# EAGLE board STM32-E407_Rev_F (EAGLE 4.16), part 1 of 2
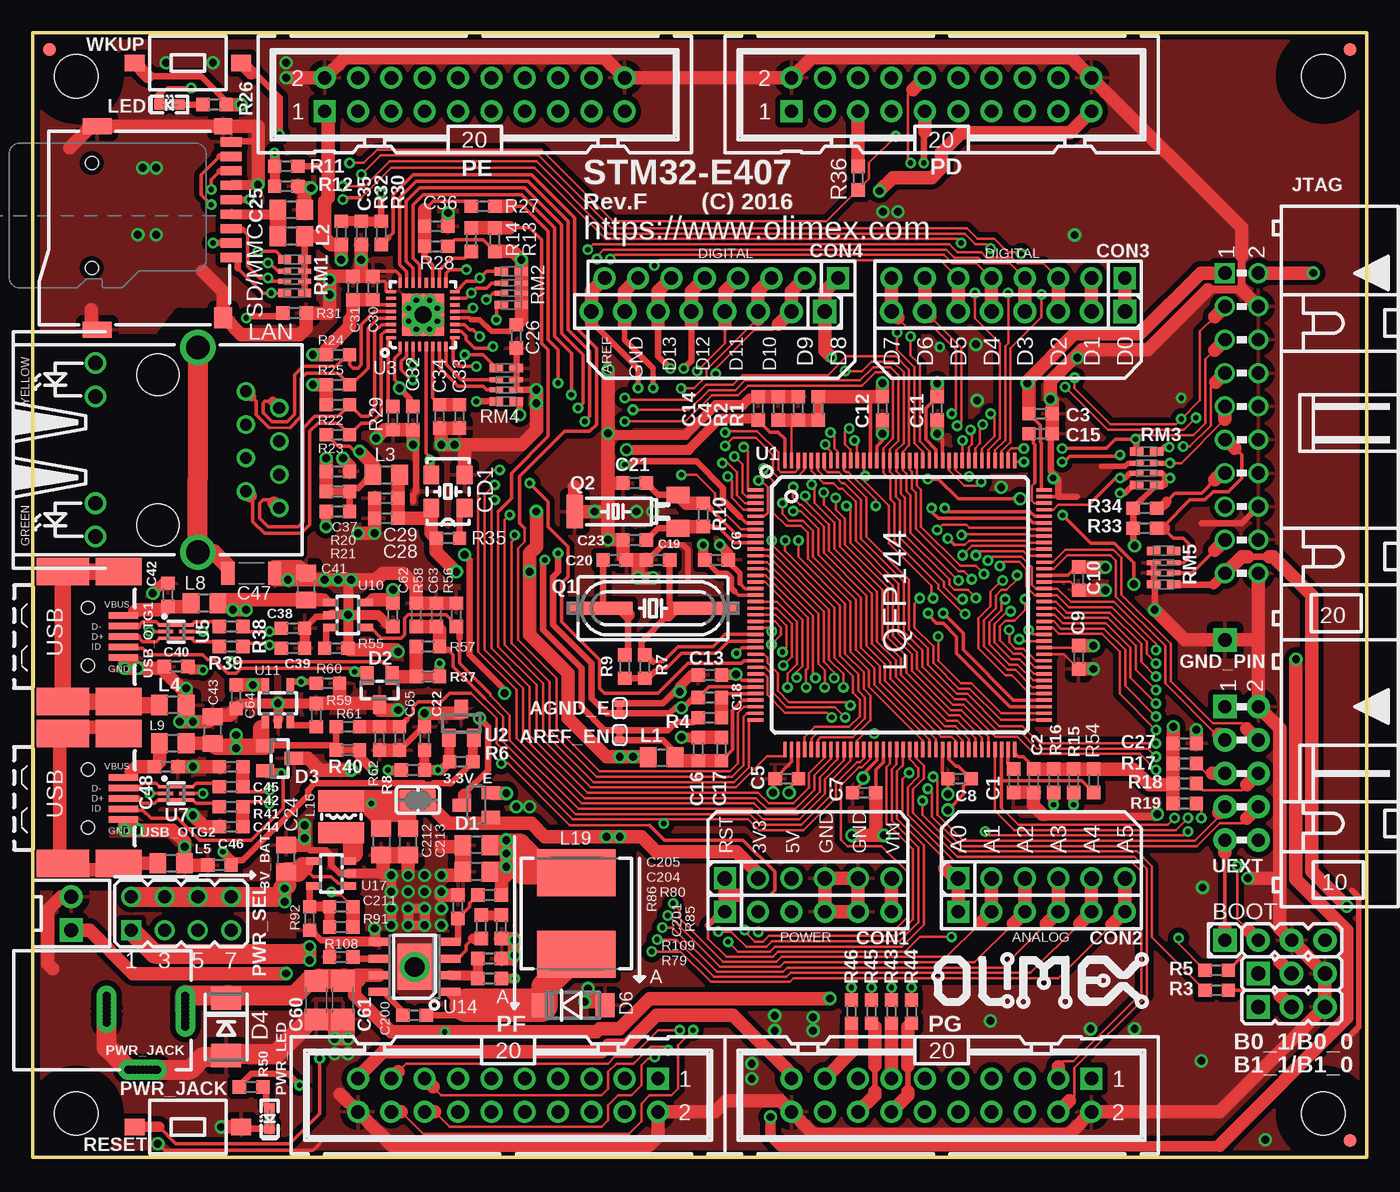
[diagram p2: board, top side]
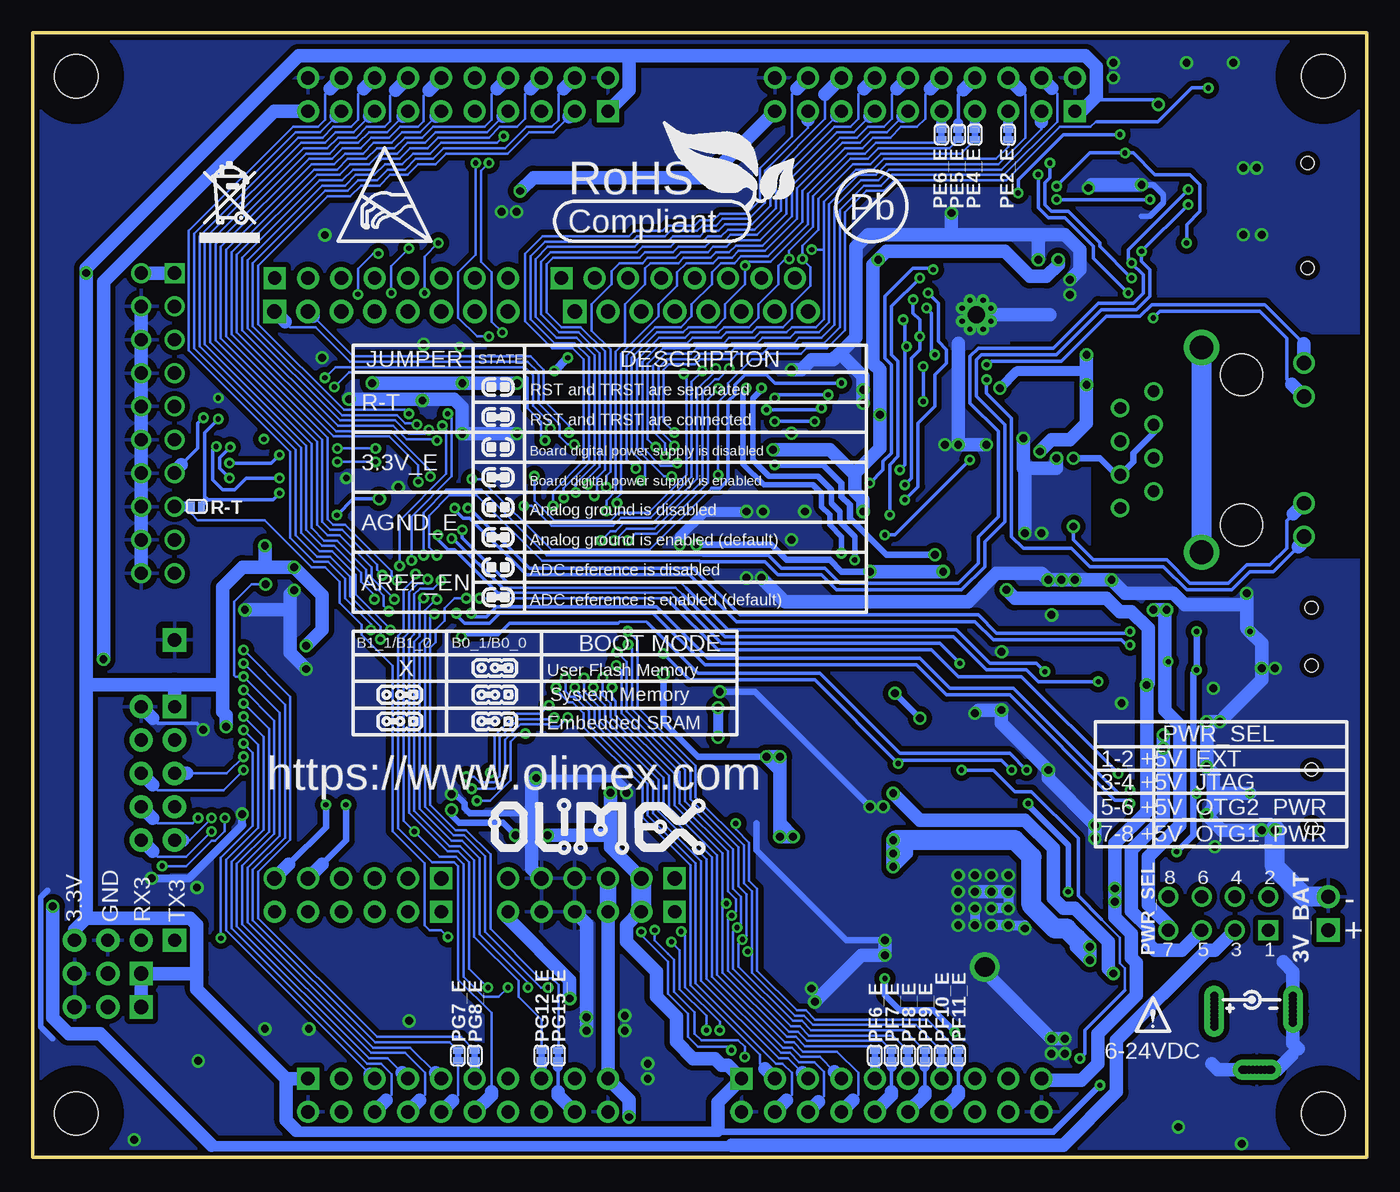
[diagram p3: board, bottom side, seen from below]

Size 101.6 x 85.6 mm. Coordinates in mm from the lower left corner, seen from the top.
Outline: 0,0 101.6,0 101.6,85.6 0,85.6 0,0
Copper layers (1+16): Top 0.035mm / dielectric 1.5mm / Bottom 0.035mm
Design rules "default": minimum track width 8mil, minimum drill 0.4mm, track to track 7mil, track to pad 7mil, pad to pad 7mil, via to via 7mil, smd to smd 1mil, copper to edge 10mil, drill to drill 8mil, minimum pad ring 10mil, minimum via ring 8mil, stop-mask expansion 4mil, vias tented up to drill 25mil, thermal gap 20mil
Net classes: 2 thin: width 0.025 mm, drill 0.025 mm; 3 gsm_pwr: width 0.914 mm, clearance 0.787 mm
Holes 3.3 mm at 3.3,82.3 98.3,82.3 98.3,3.3 3.3,3.3
tRestrict: area 0.2,79.2 to 6.4,85.4; area 95.2,79.2 to 101.4,85.4; area 95.2,0.2 to 101.4,6.4; area 0.2,0.2 to 6.4,6.4; 32 lines
bRestrict: area 0.2,79.2 to 6.4,85.4; area 95.2,79.2 to 101.4,85.4; area 95.2,0.2 to 101.4,6.4; area 0.2,0.2 to 6.4,6.4; 11 lines

## Footprints (pad centres in the part's own frame; a part is rotated, then mirrored left to right if it is on the bottom)
SJ-CLOSE = smd 1.168 x 1.6: 1 -0.762,0; 2 0.762,0
CON2.54MM-2-0 = drill 1.092 pad 1.778 square: 1 -1.27,0 | drill 1.092 pad 1.778 round: 2 1.27,0
SJ_1_SMALLER_CLOSE = smd 0.508 x 0.762: 1 -0.381,0; 2 0.381,0
JP2 = drill 1.1 pad 1.778 square: 1 -2.54,0 | drill 1.1 pad 1.778 round: 2 0,0; 3 2.54,0
HN1X4 = drill 1 pad 1.778 square: 1 -3.81,0 | drill 1 pad 1.778 round: 2 -1.27,0; 3 1.27,0; 4 3.81,0
C0603_DWS = smd 1.016 x 1.016: 1 -0.889,0; 2 0.889,0
C0805_5MIL_DWS = smd 1.27 x 1.524: 1 -1.016,0; 2 1.016,0
C1206_5MILS_WS_ISO = smd 1.016 x 1.778: 1 -1.778,0; 2 1.778,0
C1206_5MIL_WS = smd 1.651 x 1.778: 1 -1.46,0; 2 1.46,0
5032-4P_HCX-3S = smd 1.4 x 1.2: 1 -1.27,-1.27; 2 1.27,-1.27; 3 1.27,1.27; 4 -1.27,1.27
PN1X6 = drill 1.1 pad 1.676 square: 1 -6.35,0 | drill 1.1 pad 1.676 round: 2 -3.81,0; 3 -1.27,0; 4 1.27,0; 5 3.81,0; 6 6.35,0
PN1X8 = drill 1.1 pad 1.778 square: 1 -8.89,0 | drill 1.1 pad 1.778 round: 2 -6.35,0; 3 -3.81,0; 4 -1.27,0; 5 1.27,0; 6 3.81,0; 7 6.35,0; 8 8.89,0
SOT23C = smd 1.4 x 1: 1 1.1,-0.95; 2 1.1,0.95; 3 -1.1,0
SOT-23 = smd 1.4 x 1: 1 1.1,-0.95; 2 1.1,0.95; 3 -1.1,0
DO214AA = smd 1.778 x 2.286: A 2.177,0; C -2.177,0
MLL-41 = smd 1.45 x 1.8: A 2.445,0; K -2.445,0
TEST_PAD40/70/SQUARE = drill 1.016 pad 1.778 square: P$1 0,0
BH20R = drill 1.016 square: 1 -11.43,-1.27 | drill 1.016 round: 2 -11.43,1.27; 3 -8.89,-1.27; 4 -8.89,1.27; 5 -6.35,-1.27; 6 -6.35,1.27; 7 -3.81,-1.27; 8 -3.81,1.27; 9 -1.27,-1.27; 10 -1.27,1.27; 11 1.27,-1.27; 12 1.27,1.27; 13 3.81,-1.27; 14 3.81,1.27; 15 6.35,-1.27; 16 6.35,1.27; 17 8.89,-1.27; 18 8.89,1.27; 19 11.43,-1.27; 20 11.43,1.27
L0805_5MIL_DWS = smd 1.27 x 1.524: 1 -1.016,0; 2 1.016,0
CD32 = smd 1.6 x 3.5: 1 -1.2,0; 2 1.2,0
8X8MM_3131 = smd 3.6 x 6: 1 -3.1,0; 2 3.1,0
RJLBC-060TC1 = drill 0.9 round: 1 -4.455,6.7; 2 -3.185,9.24; 3 -1.915,6.7; 4 -0.645,9.24; 5 0.625,6.7; 6 1.895,9.24; 7 3.165,6.7; 8 4.435,9.24 | drill 1.1 round: AG 4.07,-4.748; AY -6.61,-4.748; KG 6.61,-4.748; KY -4.07,-4.748 | drill 1.8 round: GND1 -7.8,3.05; GND2 7.8,3.05 | hole 3.2: -5.715,0; 5.715,0
LED-0603_TEST = smd 0.8 x 0.8: A 0.762,0; C -0.762,0
ML20-MALE = drill 1.016 pad 1.676 square: 1 -11.43,-1.27 | drill 1.016 pad 1.676 round: 2 -11.43,1.27; 3 -8.89,-1.27; 4 -8.89,1.27; 5 -6.35,-1.27; 6 -6.35,1.27; 7 -3.81,-1.27; 8 -3.81,1.27; 9 -1.27,-1.27; 10 -1.27,1.27; 11 1.27,-1.27; 12 1.27,1.27; 13 3.81,-1.27; 14 3.81,1.27; 15 6.35,-1.27; 16 6.35,1.27; 17 8.89,-1.27; 18 8.89,1.27; 19 11.43,-1.27; 20 11.43,1.27
PWR_JACK_UNI_MILLING_SMALLER_DRILLS = drill 0.6 pad 1.5 round: + -0.196,4.75; +1 -0.196,5.05; +2 -0.196,5.35; +3 -0.196,5.65; +4 -0.196,4.45; +5 -0.196,4.15; +6 -0.196,3.85; +7 -0.196,3.55; +8 -0.196,5.95; - -6.196,4.75; -1 -6.196,5.05; -2 -6.196,5.35; -3 -6.196,4.45; -4 -6.196,4.15; -5 -6.196,5.65; -6 -6.196,3.85; -8 -6.196,5.95; -- -3.446,0.3; --1 -3.746,0.3; --2 -4.046,0.3; --3 -4.346,0.3; --4 -3.146,0.3; --5 -2.846,0.3; --6 -2.546,0.3; --14 -4.546,0.3; --15 -2.346,0.3
JP4Q_2 = drill 1 pad 1.524 square: 1 -3.81,-1.27 | drill 1 pad 1.524 round: 2 -3.81,1.27; 3 -1.27,-1.27; 4 -1.27,1.27; 5 1.27,-1.27; 6 1.27,1.27; 7 3.81,-1.27; 8 3.81,1.27
HC49/SMD2_THIN = smd 5 x 1: 1 -4.064,0; 2 4.064,0
TC26H_3_REPAIR_SMD = smd 1.27 x 1.778: 1 -1.27,0; 2 1.27,0 | smd 2.54 x 1.27: GND 0,7.874
0603_0R = smd 1.016 x 1.016: 1 -0.889,0; 2 0.889,0
R0603_5MIL_DWS = smd 1.016 x 1.016: 1 -0.889,0; 2 0.889,0
SJ_1_SMALLER = smd 0.508 x 0.762: 1 -0.381,0; 2 0.381,0
WS-TAKT_6X3.5_SMD_NOCREAM = smd 1.27 x 1.524: P$1 0,4.064; P$2 0,-4.064
R_MATRIX_4 = smd 0.635 x 1.016: 1.1 -1.27,-0.762; 1.2 -1.27,0.762; 4.1 1.27,-0.762; 4.2 1.27,0.762 | smd 0.381 x 1.016: 2.1 -0.381,-0.762; 2.2 -0.381,0.762; 3.1 0.381,-0.762; 3.2 0.381,0.762
TFC-WPAPR-08 = smd 1.6 x 0.7: 1 -7.375,2.25; 2 -7.375,1.15; 3 -7.375,0.05; 4 -7.375,-1.05; 5 -7.375,-2.15; 6 -7.375,-3.25; 7 -7.375,-4.35; 8 -7.375,-5.45; 9 -7.375,-6.55 | smd 1.4 x 1.2: 10 -6.75,-7.75 | smd 1.4 x 1.6: 11 -6.75,6.85 | smd 2.2 x 1.2: 12 2.85,-7.75; 13 2.85,7.75 | hole 1: 3.25,-4.95; 3.25,3.05
LQFP144 = smd 0.254 x 1.2: 1 -8.75,-11; 2 -8.25,-11; 3 -7.75,-11; 4 -7.25,-11; 5 -6.75,-11; 6 -6.25,-11; 7 -5.75,-11; 8 -5.25,-11; 9 -4.75,-11; 10 -4.25,-11; 11 -3.75,-11; 12 -3.25,-11; 13 -2.75,-11; 14 -2.25,-11; 15 -1.75,-11; 16 -1.25,-11; 17 -0.75,-11; 18 -0.25,-11; 19 0.25,-11; 20 0.75,-11; 21 1.25,-11; 22 1.75,-11; 23 2.25,-11; 24 2.75,-11; 25 3.25,-11; 26 3.75,-11; 27 4.25,-11; 28 4.75,-11; 29 5.25,-11; 30 5.75,-11; 31 6.25,-11; 32 6.75,-11; 33 7.25,-11; 34 7.75,-11; 35 8.25,-11; 36 8.75,-11; 73 8.75,11; 74 8.25,11; 75 7.75,11; 76 7.25,11; 77 6.75,11; 78 6.25,11; 79 5.75,11; 80 5.25,11; 81 4.75,11; 82 4.25,11; 83 3.75,11; 84 3.25,11; 85 2.75,11; 86 2.25,11; 87 1.75,11; 88 1.25,11; 89 0.75,11; 90 0.25,11; 91 -0.25,11; 92 -0.75,11; 93 -1.25,11; 94 -1.75,11; 95 -2.25,11; 96 -2.75,11; 97 -3.25,11; 98 -3.75,11; 99 -4.25,11; 100 -4.75,11; 101 -5.25,11; 102 -5.75,11; 103 -6.25,11; 104 -6.75,11; 105 -7.25,11; 106 -7.75,11; 107 -8.25,11; 108 -8.75,11 | smd 1.2 x 0.254: 37 11,-8.75; 38 11,-8.25; 39 11,-7.75; 40 11,-7.25; 41 11,-6.75; 42 11,-6.25; 43 11,-5.75; 44 11,-5.25; 45 11,-4.75; 46 11,-4.25; 47 11,-3.75; 48 11,-3.25; 49 11,-2.75; 50 11,-2.25; 51 11,-1.75; 52 11,-1.25; 53 11,-0.75; 54 11,-0.25; 55 11,0.25; 56 11,0.75; 57 11,1.25; 58 11,1.75; 59 11,2.25; 60 11,2.75; 61 11,3.25; 62 11,3.75; 63 11,4.25; 64 11,4.75; 65 11,5.25; 66 11,5.75; 67 11,6.25; 68 11,6.75; 69 11,7.25; 70 11,7.75; 71 11,8.25; 72 11,8.75; 109 -11,8.75; 110 -11,8.25; 111 -11,7.75; 112 -11,7.25; 113 -11,6.75; 114 -11,6.25; 115 -11,5.75; 116 -11,5.25; 117 -11,4.75; 118 -11,4.25; 119 -11,3.75; 120 -11,3.25; 121 -11,2.75; 122 -11,2.25; 123 -11,1.75; 124 -11,1.25; 125 -11,0.75; 126 -11,0.25; 127 -11,-0.25; 128 -11,-0.75; 129 -11,-1.25; 130 -11,-1.75; 131 -11,-2.25; 132 -11,-2.75; 133 -11,-3.25; 134 -11,-3.75; 135 -11,-4.25; 136 -11,-4.75; 137 -11,-5.25; 138 -11,-5.75; 139 -11,-6.25; 140 -11,-6.75; 141 -11,-7.25; 142 -11,-7.75; 143 -11,-8.25; 144 -11,-8.75
SOT23 = smd 1.4 x 1: 1 1.1,-0.95; 2 1.1,0.95; 3 -1.1,0
QFN-32(DRILLS) = smd 0.25 x 0.75: 1 -1.75,-2.425; 2 -1.25,-2.425; 3 -0.75,-2.425; 4 -0.25,-2.425; 5 0.25,-2.425; 6 0.75,-2.425; 7 1.25,-2.425; 8 1.75,-2.425; 17 1.75,2.425; 18 1.25,2.425; 19 0.75,2.425; 20 0.25,2.425; 21 -0.25,2.425; 22 -0.75,2.425; 23 -1.25,2.425; 24 -1.75,2.425 | smd 0.75 x 0.25: 9 2.425,-1.75; 10 2.425,-1.25; 11 2.425,-0.75; 12 2.425,-0.25; 13 2.425,0.25; 14 2.425,0.75; 15 2.425,1.25; 16 2.425,1.75; 25 -2.425,1.75; 26 -2.425,1.25; 27 -2.425,0.75; 28 -2.425,0.25; 29 -2.425,-0.25; 30 -2.425,-0.75; 31 -2.425,-1.25; 32 -2.425,-1.75 | drill 1.3 round: EP1 0,0 | drill 0.4 round: EP2 -0.5,1.1; EP3 0.5,1.1; EP4 1.1,0.5; EP5 1.1,-0.5; EP6 0.5,-1.1; EP7 -0.5,-1.1; EP8 -1.1,-0.5; EP9 -1.1,0.5 | smd 3.2 x 3.2: EXP_PAD 0,0
ARDUINO_SHIELD_PLATFORM_WITHOUT_DIMENSION = drill 1.016 pad 1.676 round: 3V3 22.86,2.54; 5V 25.4,2.54; A1 40.64,2.54; A2 43.18,2.54; A3 45.72,2.54; A4 48.26,2.54; A5 50.8,2.54; AREF 11.176,50.8; D1 48.26,50.8; D2 45.72,50.8; D3 43.18,50.8; D4 40.64,50.8; D5 38.1,50.8; D6 35.56,50.8; D7 33.02,50.8; D9 26.416,50.8; D10 23.876,50.8; D11 21.336,50.8; D12 18.796,50.8; D13 16.256,50.8; GND 27.94,2.54; GND@1 30.48,2.54; GND@2 13.716,50.8; VIN 33.02,2.54 | drill 1.016 pad 1.676 square: A0 38.1,2.54; D0 50.8,50.8; D8 28.956,50.8; RST 20.32,2.54
USBLC6-2P6 = smd 1.46 x 0.25: 1 0.65,-0.5; 3 0.65,0.5; 4 -0.65,0.5; 6 -0.65,-0.5 | smd 1.16 x 0.25: 2 0.8,0; 5 -0.8,0
SOT23-5 = smd 1.2 x 0.55: 1 1.3,-0.95; 2 1.3,0; 3 1.3,0.95; 4 -1.3,0.95; 5 -1.3,-0.95
SOIC8E = smd 0.61 x 1.6: 1 -1.905,-2.7; 2 -0.635,-2.7; 3 0.635,-2.7; 4 1.905,-2.7; 5 1.905,2.7; 6 0.635,2.7; 7 -0.635,2.7; 8 -1.905,2.7 | smd 3.51 x 2.62: EP 0,0 | drill 1.5 round: EP1 0,0
FIDUCIAL-1X3 = smd 1 x 1: 1 0,0
BH10R = drill 1 pad 1.778 square: 1 -5.08,-1.27 | drill 1 pad 1.778 round: 2 -5.08,1.27; 3 -2.54,-1.27; 4 -2.54,1.27; 5 0,-1.27; 6 0,1.27; 7 2.54,-1.27; 8 2.54,1.27; 9 5.08,-1.27; 10 5.08,1.27
USB_MINI_9PIN-SMALLER_CREAM = smd 2.25 x 0.5: D+ -3.722,0; D- -3.722,-0.8; GND -3.722,1.6; ID -3.722,0.8; VBUS -3.722,-1.6 | smd 4 x 2.1: GND1 0.884,-4.95; GND3 0.884,4.95 | smd 3.5 x 2.1: GND2 -3.366,-4.95; GND4 -3.366,4.95 | hole 1: -1.016,-2.2; -1.016,2.2

## Placement (x,y rotation side)
3.3V_E  Close  [SJ-CLOSE]  29.34,27.18 0 top
3V_BAT  MK-D-02-LF(WF2S)  [CON2.54MM-2-0]  2.92,18.54 90 top
AGND_E  Close  [SJ_1_SMALLER_CLOSE]  44.7,34.16 90 top
AREF_EN  Close  [SJ_1_SMALLER_CLOSE]  44.7,32.13 90 top
B0_1/B0_0  HN1x3(B0_1:Open;B0_0:Close)  [JP2]  95.89,13.97 0 top
B1_1/B1_0  HN1x3(B1_1:Open;B1_0:Close)  [JP2]  95.89,11.43 0 top
BOOT  HN1X4  [HN1X4]  94.61,16.51 0 top
C1  2.2uF/6.3V/10%/X5R/0603  [C0603_DWS]  74.7,28.65 90 top
C2  10uF/6.3V/20%/X5R/0603  [C0603_DWS]  76.23,28.65 90 top
C3  10uF/6.3V/20%/X5R/0603  [C0603_DWS]  76.76,56.59 180 top
C4  10uF/6.3V/20%/X5R/0603  [C0603_DWS]  56.77,57 270 top
C5  10uF/6.3V/20%/X5R/0603  [C0603_DWS]  57.43,28.8 0 top
C6  10uF/6.3V/20%/X5R/0603  [C0603_DWS]  52.07,45.47 180 top
C7  100nF/50V/20%/Y5V/0603  [C0603_DWS]  63.32,27.74 0 top
C8  100nF/50V/20%/Y5V/0603  [C0603_DWS]  70.59,28.8 0 top
C9  100nF/50V/20%/Y5V/0603  [C0603_DWS]  79.65,38.05 90 top
C10  100nF/50V/20%/Y5V/0603  [C0603_DWS]  79.65,44.04 90 top
C11  100nF/50V/20%/Y5V/0603  [C0603_DWS]  68.88,57 90 top
C12  100nF/50V/20%/Y5V/0603  [C0603_DWS]  64.72,57 90 top
C13  100nF/50V/20%/Y5V/0603  [C0603_DWS]  51.56,36.7 0 top
C14  100nF/50V/20%/Y5V/0603  [C0603_DWS]  55.24,57 270 top
C15  2.2uF/6.3V/10%/X5R/0603  [C0603_DWS]  76.76,55.07 180 top
C16  10uF/6.3V/20%/X5R/0603  [C0603_DWS]  50.67,31.06 90 top
C17  100nF/50V/20%/Y5V/0603  [C0603_DWS]  52.45,31.06 270 top
C18  100nF/50V/20%/Y5V/0603  [C0603_DWS]  51.56,34.98 0 top
C19  27pF/50V/5%/C0G/0603  [C0603_DWS]  47.62,45.47 180 top
C20  27pF/50V/5%/C0G/0603  [C0603_DWS]  44.32,45.47 0 top
C21  4.7pF/50V/0.1pF/C0G/0603  [C0603_DWS]  45.85,51.31 180 top
C22  100nF/50V/20%/Y5V/0603  [C0603_DWS]  29.84,31.88 270 top
C23  4.7pF/50V/0.1pF/C0G/0603  [C0603_DWS]  45.85,46.99 180 top
C24  47uF/6.3V/20%/0805  [C0805_5MIL_DWS]  19.3,22.73 90 top
C25  47uF/6.3V/20%/0805  [C0805_5MIL_DWS]  19.68,72.14 0 top
C26  100nF/50V/20%/Y5V/0603  [C0603_DWS]  36.83,62.48 90 top
C27  100nF/50V/20%/Y5V/0603  [C0603_DWS]  87.73,31.5 180 top
C28  22uF/6.3V/0603  [C0603_DWS]  26.92,48.64 0 top
C29  22uF/6.3V/0603  [C0603_DWS]  26.92,50.16 0 top
C30  22uF/6.3V/0603  [C0603_DWS]  25.91,66.17 270 top
C31  100nF/50V/20%/Y5V/0603  [C0603_DWS]  24.38,66.17 270 top
C32  100nF/50V/20%/Y5V/0603  [C0603_DWS]  28.96,56.26 90 top
C33  2.2uF/6.3V/10%/X5R/0603  [C0603_DWS]  32.51,56.39 90 top
C34  100nF/50V/20%/Y5V/0603  [C0603_DWS]  30.99,56.39 90 top
C35  100nF/50V/20%/Y5V/0603  [C0603_DWS]  23.5,70.36 270 top
C36  10uF/6.3V/20%/X5R/0603  [C0603_DWS]  30.73,70.87 180 top
C37  100nF/50V/20%/Y5V/0603  [C0603_DWS]  23.24,52.2 180 top
C38  NA(47pF)  [C0603_DWS]  19.81,40.26 0 top
C39  NA(47pF)  [C0603_DWS]  19.81,38.73 0 top
C40  100nF/50V/20%/Y5V/0603  [C0603_DWS]  10.92,37.34 0 top
C41  47uF/6.3V/20%/0805  [C0805_5MIL_DWS]  20.83,43.43 90 top
C42  100nF/50V/20%/Y5V/0603  [C0603_DWS]  10.29,42.8 90 top
C43  47uF/6.3V/20%/0805  [C0805_5MIL_DWS]  13.72,32.51 90 top
C44  NA(47pF)  [C0603_DWS]  15.11,25.15 180 top
C45  NA(47pF)  [C0603_DWS]  15.11,29.72 180 top
C46  100nF/50V/20%/Y5V/0603  [C0603_DWS]  14.22,22.23 0 top
C47  1nF/2kV/X7R/1206  [C1206_5MILS_WS_ISO]  16.64,44.45 180 top
C48  100nF/50V/20%/Y5V/0603  [C0603_DWS]  10.16,29.72 0 top
C60  10uF/50V/10%/1206  [C1206_5MIL_WS]  21.59,11.94 270 top
C61  10uF/50V/10%/1206  [C1206_5MIL_WS]  23.62,11.94 270 top
C62  22uF/6.3V/0603  [C0603_DWS]  27.43,41.27 270 top
C63  100nF/50V/20%/Y5V/0603  [C0603_DWS]  30.73,41.27 90 top
C64  22uF/6.3V/0603  [C0603_DWS]  15.49,35.05 270 top
C65  100nF/50V/20%/Y5V/0603  [C0603_DWS]  27.94,31.88 270 top
C200  100nF/50V/20%/Y5V/0603  [C0603_DWS]  29.08,10.79 0 top
C201  150pF/50V/10%/0603  [C0603_DWS]  34.16,17.53 90 top
C204  47uF/6.3V/20%/0805  [C0805_5MIL_DWS]  33.78,21.72 180 top
C205  47uF/6.3V/20%/0805  [C0805_5MIL_DWS]  33.78,23.75 180 top
C211  27pF/50V/5%/C0G/0603  [C0603_DWS]  23.5,19.05 180 top
C212  47uF/6.3V/20%/0805  [C0805_5MIL_DWS]  26.54,24 270 top
C213  47uF/6.3V/20%/0805  [C0805_5MIL_DWS]  28.57,24 270 top
CD1  6NC2-50MHz(5032_50MHZ_25ppm_3V)  [5032-4P_HCX-3S]  31.62,50.67 90 top
CON1  NA(PN1X6)  [PN1X6]  59.05,21.21 0 top
CON2  NA(PN1X6)  [PN1X6]  76.83,21.21 0 top
CON3  NA(PN1X8)  [PN1X8]  74.3,64.39 180 top
CON4  NA(PN1X8)  [PN1X8]  51.44,64.39 180 top
D1  BAT54C  [SOT23C]  33.78,26.8 0 top
D2  NA(ESDA6V1L)  [SOT-23]  26.42,35.56 90 top
D3  NA(ESDA6V1L)  [SOT-23]  18.8,30.35 180 top
D4  SMBJ26CA  [DO214AA]  14.73,9.91 270 top
D6  1N5822/SS34/SMA  [MLL-41]  41.15,11.56 0 top
GND_PIN  TESTPAD3  [TEST_PAD40/70/SQUARE]  90.81,39.37 0 top
JTAG  BH20R  [BH20R]  92.08,55.88 270 top
L1  FB0805/600R/2A/0805  [L0805_5MIL_DWS]  47.9,30.43 0 top
L2  FB0805/600R/2A/0805  [L0805_5MIL_DWS]  19.68,70.1 180 top
L3  FB0805/600R/2A/0805  [L0805_5MIL_DWS]  26.92,51.94 0 top
L4  FB0805/600R/2A/0805  [L0805_5MIL_DWS]  10.67,34.42 180 top
L5  FB0805/600R/2A/0805  [L0805_5MIL_DWS]  10.54,22.35 180 top
L8  FB0805/600R/2A/0805  [L0805_5MIL_DWS]  13.08,42.16 180 top
L9  FB0805/600R/2A/0805  [L0805_5MIL_DWS]  10.67,31.5 180 top
L16  2.2uH/1.5A/DCR<0.1R/CD32  [CD32]  23.5,25.91 90 top
L19  15uH/YS75  [8X8MM_3131]  41.4,18.54 90 top
LAN  RJLD-060TC1  [RJLBC-060TC1]  9.53,53.85 270 top
LED  LED/GREEN/0603  [LED-0603_TEST]  10.41,80.14 0 top
PD  NA(BH20S)  [ML20-MALE]  69.22,80.9 0 top
PE  NA(BH20S)  [ML20-MALE]  33.66,80.9 0 top
PE2_E  Close  [SJ_1_SMALLER_CLOSE]  27.3,77.85 90 bottom
PE4_E  Close  [SJ_1_SMALLER_CLOSE]  29.84,77.85 90 bottom
PE5_E  Close  [SJ_1_SMALLER_CLOSE]  31.11,77.85 270 bottom
PE6_E  Close  [SJ_1_SMALLER_CLOSE]  32.38,77.85 90 bottom
PF  NA(BH20S)  [ML20-MALE]  36.2,4.7 180 top
PF6_E  Close  [SJ_1_SMALLER_CLOSE]  37.47,7.72 270 bottom
PF7_E  Close  [SJ_1_SMALLER_CLOSE]  36.2,7.72 90 bottom
PF8_E  Close  [SJ_1_SMALLER_CLOSE]  34.92,7.72 270 bottom
PF9_E  Close  [SJ_1_SMALLER_CLOSE]  33.66,7.72 90 bottom
PF10_E  Close  [SJ_1_SMALLER_CLOSE]  32.38,7.72 270 bottom
PF11_E  Close  [SJ_1_SMALLER_CLOSE]  31.11,7.72 90 bottom
PG  NA(BH20S)  [ML20-MALE]  69.22,4.7 180 top
PG7_E  Close  [SJ_1_SMALLER_CLOSE]  69.22,7.72 90 bottom
PG8_E  Close  [SJ_1_SMALLER_CLOSE]  67.94,7.72 270 bottom
PG12_E  Close  [SJ_1_SMALLER_CLOSE]  62.87,7.72 270 bottom
PG15_E  Close  [SJ_1_SMALLER_CLOSE]  61.59,7.72 90 bottom
PWR_JACK  PWRJ-2mm(YDJ-1134)  [PWR_JACK_UNI_MILLING_SMALLER_DRILLS]  11.81,6.35 0 top
PWR_LED  LED/RED/0603  [LED-0603_TEST]  18.03,2.92 90 top
PWR_SEL  HN2x4(1-2:Close)  [JP4Q_2]  11.3,18.54 0 top
Q1  12Mhz/30ppm/20pf  [HC49/SMD2_THIN]  47.24,41.78 0 top
Q2  32768Hz/6pF  [TC26H_3_REPAIR_SMD]  49.15,49.15 90 top
R1  0R(board_mounted)  [0603_0R]  59.82,57 90 top
R2  NA  [R0603_5MIL_DWS]  58.29,57 90 top
R3  4.7k/5%/0603  [R0603_5MIL_DWS]  90.17,12.7 0 top
R4  22R/5%/0603  [R0603_5MIL_DWS]  51.56,33.45 0 top
R5  4.7k/5%/0603  [R0603_5MIL_DWS]  90.17,14.22 0 top
R6  10k/5%/0603  [R0603_5MIL_DWS]  32.64,30.1 0 top
R7  NA  [R0603_5MIL_DWS]  46.61,37.34 90 top
R8  1.1k/1%/0603  [R0603_5MIL_DWS]  28.96,29.46 0 top
R9  150R/5%/0603  [R0603_5MIL_DWS]  45.09,37.34 270 top
R10  NA  [R0603_5MIL_DWS]  51.05,48.9 90 top
R11  NA  [R0603_5MIL_DWS]  19.3,75.44 180 top
R12  1M/5%/0603  [R0603_5MIL_DWS]  19.3,73.91 0 top
R13  2k/1%/0603  [R0603_5MIL_DWS]  35.18,69.85 270 top
R14  150R/5%/0603  [R0603_5MIL_DWS]  33.4,69.85 270 top
R15  NA(10k)  [R0603_5MIL_DWS]  79.27,28.65 90 top
R16  NA(10k)  [R0603_5MIL_DWS]  77.75,28.65 90 top
R17  4.7k/5%/0603  [R0603_5MIL_DWS]  87.73,29.97 180 top
R18  4.7k/5%/0603  [R0603_5MIL_DWS]  87.73,28.45 180 top
R19  47k/5%/0603  [R0603_5MIL_DWS]  87.73,26.92 180 top
R20  0R(board_mounted)  [0603_0R]  23.24,50.67 0 top
R21  1.1k/1%/0603  [R0603_5MIL_DWS]  23.24,49.15 180 top
R22  49.9R/1%/0603  [R0603_5MIL_DWS]  23.24,57.28 180 top
R23  49.9R/1%/0603  [R0603_5MIL_DWS]  23.24,54.99 180 top
R24  49.9R/1%/0603  [R0603_5MIL_DWS]  23.24,61.09 180 top
R25  49.9R/1%/0603  [R0603_5MIL_DWS]  23.24,58.8 180 top
R26  2k/1%/0603  [R0603_5MIL_DWS]  13.84,80.14 0 top
R27  NA  [R0603_5MIL_DWS]  34.29,72.39 180 top
R28  10k/5%/0603  [R0603_5MIL_DWS]  30.73,69.34 180 top
R29  12.1k/1%/0603  [R0603_5MIL_DWS]  27.43,56.26 90 top
R30  1.1k/1%/0603  [R0603_5MIL_DWS]  26.54,70.36 270 top
R31  1.1k/1%/0603  [R0603_5MIL_DWS]  19.94,64.26 0 top
R32  47k/5%/0603  [R0603_5MIL_DWS]  25.02,70.36 90 top
R33  NA  [R0603_5MIL_DWS]  84.71,47.88 180 top
R34  NA  [R0603_5MIL_DWS]  84.71,49.4 180 top
R35  47k/5%/0603  [R0603_5MIL_DWS]  31.62,47.12 0 top
R36  NA  [R0603_5MIL_DWS]  62.87,74.52 270 top
R37  0R(board_mounted)  [0603_0R]  30.1,36.58 180 top
R38  22R/5%/0603  [R0603_5MIL_DWS]  15.11,40.39 180 top
R39  22R/5%/0603  [R0603_5MIL_DWS]  15.11,38.86 180 top
R40  0R(board_mounted)  [0603_0R]  24,30.99 180 top
R41  22R/5%/0603  [R0603_5MIL_DWS]  15.11,26.67 180 top
R42  22R/5%/0603  [R0603_5MIL_DWS]  15.11,28.19 180 top
R43  NA  [R0603_5MIL_DWS]  65.41,11.07 90 top
R44  NA  [R0603_5MIL_DWS]  66.93,11.07 270 top
R45  NA  [R0603_5MIL_DWS]  63.88,11.07 270 top
R46  NA  [R0603_5MIL_DWS]  62.36,11.07 90 top
R50  2k/1%/0603  [R0603_5MIL_DWS]  16.64,5.33 0 top
R54  47k/5%/0603  [R0603_5MIL_DWS]  80.8,28.65 90 top
R55  6.81k/1%/0603  [R0603_5MIL_DWS]  23.11,38.73 180 top
R56  10k/5%/0603  [R0603_5MIL_DWS]  32.26,41.27 270 top
R57  4.99k/1%/0603  [R0603_5MIL_DWS]  30.1,38.86 180 top
R58  10k/5%/0603  [R0603_5MIL_DWS]  29.21,41.27 270 top
R59  6.81k/1%/0603  [R0603_5MIL_DWS]  21.59,33.66 270 top
R60  10k/5%/0603  [R0603_5MIL_DWS]  22.48,36.07 180 top
R61  4.99k/1%/0603  [R0603_5MIL_DWS]  24,32.77 180 top
R62  10k/5%/0603  [R0603_5MIL_DWS]  26.42,31.88 90 top
R79  NA(100k)  [R0603_5MIL_DWS]  34.8,13.59 180 top
R80  11k/1%/0603  [R0603_5MIL_DWS]  34.8,19.94 0 top
R85  100k/5%/0603  [R0603_5MIL_DWS]  35.69,17.53 270 top
R86  2k/1%/0603  [R0603_5MIL_DWS]  32.38,19.05 90 top
R91  4.99k/1%/0603  [R0603_5MIL_DWS]  23.5,17.53 180 top
R92  1.1k/1%/0603  [R0603_5MIL_DWS]  21.08,18.16 270 top
R108  100k/5%/0603  [R0603_5MIL_DWS]  23.5,15.24 180 top
R109  NA(47k)  [R0603_5MIL_DWS]  34.8,15.11 0 top
R-T  Open  [SJ_1_SMALLER]  89.13,49.53 180 bottom
RESET  T1107A(6X3,8X2,5MM)  [WS-TAKT_6X3.5_SMD_NOCREAM]  11.81,2.29 90 top
RM1  RA1206_(4X0603)_4B8_33k  [R_MATRIX_4]  19.94,67.06 270 top
RM2  RA1206_(4X0603)_4B8_4.7k  [R_MATRIX_4]  36.45,66.17 90 top
RM3  NA(10k)  [R_MATRIX_4]  84.84,52.45 270 top
RM4  RA1206_(4X0603)_4B8_4.7k  [R_MATRIX_4]  36.07,58.8 270 top
RM5  RA1206_(4X0603)_4B8_10k  [R_MATRIX_4]  86.13,44.88 90 top
SD/MMC  TFC-WPAPR-08  [TFC-WPAPR-08]  7.75,70.74 180 top
U1  STM32F407ZET6  [LQFP144]  66.04,42.04 270 top
U2  NA  [SOT23]  32.64,33.02 270 top
U3  LAN8710A-EZC  [QFN-32(DRILLS)]  29.72,64.14 0 top
U4  NA(2xPN1x6_2xPN1x8)  [ARDUINO_SHIELD_PLATFORM_WITHOUT_DIMENSION]  32.38,16.13 0 top
U5  NA(USBLC6-2P6)  [USBLC6-2P6]  10.92,40.01 180 top
U7  NA(USBLC6-2P6)  [USBLC6-2P6]  10.92,27.69 180 top
U10  SY6280  [SOT23-5]  24,41.27 180 top
U11  SY6280  [SOT23-5]  18.67,34.54 270 top
U14  MP1584EN(SOIC8E)  [SOIC8E]  29.08,14.48 90 top
U17  SY8009AAAC(SOT23-5)  [SOT23-5]  22.73,21.59 0 top
U$1  FIDUCIAL  [FIDUCIAL-1X3]  1.27,84.33 0 top
U$2  FIDUCIAL  [FIDUCIAL-1X3]  100.33,84.33 0 top
U$3  FIDUCIAL  [FIDUCIAL-1X3]  100.33,1.27 0 top
U$4  [OLIMEX1_V]  49.2,22.89 0 bottom
U$5  [ESD_SYMBOL]  78.36,69.72 0 bottom
U$6  [PB]  37.72,72.39 0 bottom
U$7  [OLIMEX1_V]  86.16,11.18 0 top
U$8  [RECYCLE_BIN1/8]  88.9,69.6 0 bottom
U$15  [ROHS]  60.83,70.36 0 bottom
U$16  [ATTENTION_SMALL]  17.55,9.58 0 bottom
UEXT  BH10R  [BH10R]  92.08,29.21 270 top
USB_OTG1  USB-OTG(MSB-SW-5AB-LF)  [USB_MINI_9PIN-SMALLER_CREAM]  3.17,39.62 180 top
USB_OTG2  USB-OTG(MSB-SW-5AB-LF)  [USB_MINI_9PIN-SMALLER_CREAM]  3.17,27.3 180 top
WKUP  T1107A(6X3,8X2,5MM)  [WS-TAKT_6X3.5_SMD_NOCREAM]  11.81,83.31 90 top

## Tracks (layer width: path | path; a pad name or v marks a point on that pad's centre or on a via)
+5V  (via drill 0.6)
  Top 0.254: U17.1 23.84,20.83 23.24,20.83 22.73,21.34 21.34,21.34 20.7,21.97 20.7,22.1
  Top 0.508: U17.4 20.99,22.1 20.7,22.1 20.57,22.1 | U11.5 17.72,35.94 17.4,35.94 | 26.04,42.42 26.04,42.67 25.75,42.67 U10.5
  Top 0.813: 90.4,0.91 90.3,0.81 56.95,0.81 56.19,1.57 v56.19,3.05
  Top 1.016: PD.19 78.99,77.98 70.74,77.98 69.22,76.45 69.22,75.31 68.48,74.57 65.51,74.57 v64.49,73.56 | v96.22,37.9 96.22,21.13 100.08,17.27 100.08,10.59 90.4,0.91 | C64.1 v16.76,35.94 17.4,35.94 | v27.43,43.18 27.43,42.42 | PF.19 24.77,6.1 26.67,8 43.31,8 43.81,8.51 45.21,8.51 47.5,10.79 53.34,10.79 57.78,6.35 PG.19 | 19.18,19.81 v19.18,20.45 | 19.18,19.81 v19.18,19.43 | 18.54,19.81 19.18,19.81 | 27.43,42.42 C62.1 | 27.43,42.42 26.04,42.42
  Top 1.27: v19.18,20.45 19.05,20.45
  Top 1.524: PWR_SEL.2 PWR_SEL.4 PWR_SEL.6 PWR_SEL.8 18.54,19.81 | 20.57,22.1 20.19,21.72 C24.1 19.3,20.7 19.05,20.45
  Bottom 1.016: U4.5V PG.19 56.19,4.37 v56.19,3.05 | PF.19 24.64,5.84 21.72,5.84 20.47,7.09 20.47,9.37 17.53,12.32 17.53,14.78 17.91,15.16 17.91,16.99 19.18,18.26 v19.18,19.43 v19.18,20.45 19.18,23.88 16.76,26.29 v16.76,35.94 16.64,36.07 16.64,40.26 17.91,41.53 18.8,41.53 19.81,42.55 26.8,42.55 v27.43,43.18 | v64.49,73.56 63.48,74.57 50.14,74.57 PE.19 | PD.19 83.24,79.63 96.22,66.65 v96.22,37.9
  Bottom 1.27: U4.5V CON1.3
+5V_EXT  (via drill 0.6)
  Top 1.016: 20.57,15.49 v21.08,16 v21.08,14.99 | v36.07,22.1 36.07,21.97 35.05,21.97 C204.1 | v36.07,22.1 v36.07,23.11 36.07,23.75 v36.07,24.13 37.08,24.13 37.08,23.75 | v36.07,22.1 36.07,21.46 35.69,21.08 R80.2 | v36.07,22.1 36.83,22.1
  Top 1.27: 35.18,23.75 C205.1
  Top 1.524: PWR_SEL.1 9.27,15.49 20.57,15.49 | 36.07,23.75 35.18,23.75
  Top 1.778: 39.92,21.64 37.29,21.64 36.83,22.1 | 39.92,21.64 L19.2 | 39.92,21.64 39.19,21.64 37.08,23.75
  Bottom 1.016: 35.81,24.13 v36.07,24.13 v36.07,23.11 v36.07,22.1 35.05,23.11 35.05,24 | v21.08,16 v21.08,14.99 22.1,16 22.1,16.64 21.72,16.64 v21.08,16
  Bottom 1.524: 22.1,16.64 22.86,17.4 23.75,17.4 25.53,19.18 25.53,22.86 26.8,24.13 35.81,24.13
+5V_JTAG  (via drill 0.6)
  Top 0.508: 94.18,45.72 92.56,45.72 | 89.94,43.59 89.92,43.56 86.94,43.56 RM5.1.1
  Top 0.762: JTAG.19 89.94,43.59
  Top 1.016: JTAG.19 92.08,45.72 92.56,45.72 | 94.18,45.72 94.49,45.72 97.43,42.77 97.43,21.74 v100.08,19.1
  Bottom 0.813: 87.99,0.91 87.88,0.81 48.46,0.81 48.39,0.89
  Bottom 1.016: v100.08,19.1 100.08,10.59 98.88,9.4 96.47,9.4 87.99,0.91 | PWR_SEL.3 11.56,15.75 12.19,15.75 19.05,8.89 19.05,4.95 23.11,0.89 48.39,0.89
+5V_OTG1_PWR  (via drill 0.4, 0.6)
  Top 0.254: D2.1 27.37,37.02 26.67,37.72 v15.11,37.72
  Top 0.508: U10.1 22.26,42.67 21.97,42.67 21.97,42.42
  Top 1.016: L8.1 14.35,42.42 15.24,42.42 | 15.24,42.42 v15.24,41.66 v16.26,41.66 | 15.24,42.42 C41.1 21.97,42.42 | R57.2 R37.2 27.37,36.58 D2.1
  Bottom 0.508: 15.37,37.72 v15.11,37.72
  Bottom 1.016: PWR_SEL.7 15.11,17.68 16.64,19.2 16.64,22.86 14.22,25.27 14.22,32.89 15.37,34.04 15.37,37.72 15.37,41.66 | 15.37,41.66 v15.24,41.66 | 15.37,41.66 v16.26,41.66
+5V_OTG2_PWR  (via drill 0.6)
  Top 0.508: U11.1 17.4,32.92 17.4,32.64 | D3.1 17.76,31.37 23.11,31.37 | 23.11,31.37 R40.2 | 23.11,31.37 R61.2
  Top 1.016: C43.1 L9.1 | v15.49,32.13 15.49,31.24 v15.49,31.11
  Top 1.27: C43.1 13.97,31.24 15.49,31.24 17.4,31.24 | D3.1 17.7,31.24 17.4,31.24 | 17.4,31.24 17.4,32.64
  Bottom 1.016: PWR_SEL.5 14.1,15.75 16.13,15.75 16.64,16.26 16.64,17.45 17.91,18.72 17.91,23.37 15.49,25.78 v15.49,31.11 v15.49,32.13
+7V
  Top 0.254: C17.2 53.29,31.01 53.29,34.01 54.07,34.79 U1.33
  Top 0.508: 48.92,30.84 48.01,31.75 AREF_EN.1
  Top 0.762: 48.92,30.84 L1.2
  Top 1.016: C17.2 C16.1 49.17,30.18 L1.2
+15V  (via drill 0.4, 0.6)
  Top 0.762: v36.7,13.59 R79.1
  Top 1.016: U4.VIN CON1.6 | v60.71,12.06 46.99,12.06 44.7,9.78 43.18,9.78 42.93,9.53 v31.37,9.53 27.3,9.53 24.51,12.32 24.51,13.4 C61.1 | U14.7 24.89,13.84 24.64,13.59
  Top 1.524: PWR_JACK.+ 11.62,12.32 14.73,12.32 D4.C 14.97,12.32 19.94,12.32 21.02,13.4 C60.1 21.78,13.59 23.62,13.59 C61.1 23.81,13.59 24.64,13.59
  Bottom 0.508: v36.7,13.59 36.7,12.32 35.56,11.18 33.02,11.18 v31.37,9.53
  Bottom 1.016: v60.71,12.06 60.71,13.46 65.41,18.16 U4.VIN
AGND  (via drill 0.4, 0.6)
  Top 0.254: U1.31 53.22,35.79 53.19,35.81 51.51,35.81 C18.1
  Top 0.406: v47.24,58.55 47.24,60.07 45.09,62.23 45.09,63.4
  Top 0.508: v40.01,45.97 40.01,44.58 39.62,44.2 39.62,40.51 42.55,37.59 42.55,34.92 43.69,33.78 AGND_E.1 48.51,33.78 48.95,34.21 v49.4,34.21 49.58,34.21 50.34,34.98 C18.1
  Top 0.762: v49.4,31.95 C16.2
  Top 1.016: U4.GND@2 45.09,65.91 CON4.7 45.09,63.4 | C16.2 C17.1
  Bottom 0.406: v47.24,58.55 47.24,58.42 47.5,58.17 47.5,52.76 45.92,51.18 42.16,51.18 41.53,50.55 41.53,49.53 40.89,48.9 40.89,48.13 40.01,47.24 v40.01,45.97
  Bottom 0.762: v49.4,34.21 v49.4,31.95
AREF  (via drill 0.4)
  Top 0.406: 42.55,63.52 42.65,63.52 46.1,60.07 v46.1,58.55
  Top 0.508: R4.1 50.34,33.12 49,33.12 48.39,32.51 AREF_EN.2 43.56,32.51 41.78,34.29 41.78,37.21 38.86,40.13 38.86,45.34 v38.99,45.47
  Top 1.016: U4.AREF 42.55,65.91 CON4.8 42.55,63.52
  Bottom 0.406: v46.1,58.55 46.1,58.42 46.76,57.76 46.76,53.06 45.52,51.82 41.78,51.82 40.77,50.8 40.77,49.78 40.13,49.15 40.13,48.39 38.99,47.24 v38.99,45.47
BOOT0  (via drill 0.4)
  Top 0.203: U1.138 60.29,52.36 60.53,52.12 61.39,52.12 61.8,51.71 61.98,51.71 63.5,50.19 63.5,47.22 66.75,43.97 66.75,40.16 68.17,38.73 68.17,37.47 70.38,35.26 71.2,35.26 73.64,32.82 75.39,32.82 76.7,31.51 85.54,31.51 v85.55,31.5 | R5.1 87.27,16.23 v87.27,16.66
  Bottom 0.203: v85.55,31.5 84.84,30.79 84.84,25.22 87.27,22.78 v87.27,16.66
GND  (via drill 0.4, 0.5, 0.6)
  Top 0.203: U1.94 79.02,43.79 C10.1 | U1.83 78.53,38.29 C9.1
  Top 0.254: v8.89,40.01 U5.2 | v8.89,27.69 U7.2 | 78.13,50.29 U1.107 | U1.130 64.29,54.1 64.72,54.53 v64.72,55.07 | U1.51 64.29,30.2 63.25,29.16 v63.25,28.85 63.25,28.55 C7.1 | v69.7,27.64 C8.1 69.29,29.21 U1.61 | U1.38 57.79,30.08 56.52,28.8 C5.1 56.39,28.65 v56.39,27.74 | U1.120 69.29,54.66 v68.89,55.07 | U3.24 27.97,67.16 27.69,67.44 25.91,67.44 C30.1 25.91,66.67 26.8,66.67 26.92,66.55 26.92,65.91 26.95,65.89 U3.25 | U1.16 54.25,43.29 53.85,43.69 | v9.53,1.02 10.03,0.51 21.34,0.51 22.35,1.52
  Top 0.406: 100.48,20.3 101.02,19.76 101.02,9.93 100.08,8.99 | 53.85,43.69 53.85,44.45 52.96,45.34 C6.1 | RM3.2.1 83.44,52.83 83.19,52.58 81.41,52.58 | 46.61,45.47 46.86,45.47 48.01,46.61 49.53,46.61 49.91,46.23 49.91,43.94
  Top 0.508: 79.52,50.29 78.13,50.29 78.13,51.61 77.55,52.2 77.55,54.97 C15.1 | RM5.3.2 RM5.2.2 RM5.1.2 85.45,43.69 v85.45,41.66 | v38.35,58.42 RM4.3.2 RM4.2.2 RM4.1.2 C26.1 | 20.83,17.27 R92.2 21.18,17.27 21.95,16.51 22.61,16.51 22.61,16.38 | U17.2 23.37,21.59 22.73,22.23 22.73,22.99 22.35,23.37 21.08,23.37 20.7,23.75 | C22.1 29.72,32.77 C65.2 | USB_OTG2.GND 6.99,25.7 6.99,25.27 | USB_OTG1.GND 6.99,38.02 6.99,37.59 | U10.2 22.7,41.15 21.59,41.15 C38.2 | AGND_E.2 48.01,34.54 48.9,35.43 v49.28,35.43 | v28.96,54.23 29.21,53.98 29.21,50.67 28.96,50.42 28.96,49.91 | SD/MMC.9 15.18,77.34 17.14,77.34 | RESET.P$2 16,2.16 PWR_LED.C | JTAG.16 92.08,48.26 89.03,48.26
  Top 0.61: 89.51,66.04 92.08,66.04 92.08,68.63 | 76.89,26.11 77.09,25.91 85.45,25.91 v85.65,26.11
  Top 0.762: C14.1 55.12,57.76 54.59,57.76 54.1,57.28 52.02,57.28 49.73,54.99 43.81,54.99 | v24,41.27 U10.2 | v18.67,34.54 U11.2 | v27.3,20.19 v27.3,21.46 27.3,21.59 26.67,21.59 U17.2 | v27.3,18.92 v27.3,17.65 | R108.2 22.61,16.38 26.04,16.38 | 26.04,16.38 U14.5 | v26.04,17.4 26.04,16.38 | v8,24.89 8,25.02 7.75,25.27 6.99,25.27 | v18.67,34.54 R59.1 | v18.67,34.54 15.88,34.54 C64.2 | C38.2 C39.2 | 24,43.94 v24,41.27 | C62.2 27.18,40.39 26.29,41.27 v24,41.27 | C42.2 9.91,43.69 v9.14,42.93 | v24,41.27 R55.1 | C13.1 50.16,36.7 49.28,35.81 v49.28,35.43 | C6.1 52.96,45.97 v52.32,46.61 | SD/MMC.6 17.14,73.99 v17.14,74.04 | v28.57,18.92 v28.57,17.65 v29.84,17.65 v29.84,18.92 v28.57,18.92
  Top 0.813: 59.28,1.93 59.28,1.83 79.05,1.83 79.15,1.93 | 26.26,1.93 26.36,1.83
  Top 1.016: R2.2 C4.1 C14.1 | v64.72,55.07 C12.1 | v68.89,55.07 C11.1 | C15.1 C3.1 77.65,57.58 v77.52,57.71 77.52,59.08 79.91,61.47 84.94,61.47 89.51,66.04 | 95,21.23 95,17.4 BOOT.3 B0_1/B0_0.3 B1_1/B1_0.3 90.42,3.43 PG.2 79.15,1.93 | 95,21.23 95,32.64 UEXT.2 93.34,39.37 | 93.34,39.37 JTAG.20 | 93.34,39.37 GND_PIN.P$1 87.73,39.37 v85.45,41.66 | v81.69,43.16 C10.1 | v88.62,32.54 C27.1 | 59.28,1.93 PG.20 56.95,4.27 52.78,4.27 51.94,3.43 PF.2 47.62,1.52 46.99,0.89 27.3,0.89 26.36,1.83 | 26.26,1.93 PF.20 23.42,4.78 | v80.77,37.16 C9.1 | 92.08,68.63 92.08,70.74 PD.20 79.1,83.72 59.33,83.72 PD.2 PE.20 43.54,83.72 23.77,83.72 PE.2 19.38,82.17 | JTAG.4 92.08,66.04 | 25.02,67.06 v25.02,68.33 R32.1 | C45.2 v12.19,29.72 C48.2 | v14.35,2.29 RESET.P$2 | 76.89,26.11 76.22,26.77 C2.1 C1.1 | 95,21.23 v92.56,21.23 | v43.81,59.94 v43.81,55.12 43.81,54.99 43.81,51.31 | 25.02,67.06 C31.1 22.61,67.06 v22.61,66.8 v22.61,65.66 22.61,64.26 R31.2 20.83,63.12 20.32,62.61 15.88,62.61 14.6,63.89 SD/MMC.11 14.5,65.89 12.95,67.44 | 25.02,67.06 C30.1 | C32.1 R29.1 | v28.96,54.23 C32.1 | C32.1 R29.1 | 31.11,55.5 C33.1 | 32.89,54.23 37.21,54.23 38.35,55.37 v38.35,58.42 | 32.89,54.23 v32.13,54.23 v31.11,54.23 31.11,55.5 | 32.89,54.23 CD1.2 | 31.11,55.5 C34.1 | v31.62,71.88 C36.1 | R55.1 24.13,38.61 27.69,38.61 v27.81,38.48 | C61.2 24,10.48 v24,9.02 v22.99,9.02 22.99,10.41 23.11,10.54 | R109.2 36.45,15.11 v36.7,15.37 v36.7,16.51 36.7,16.64 R85.2 | D6.A 43.59,11.81 v42.04,11.81 42.29,11.81 v42.29,12.83 | v12.19,26.04 13.08,25.15 C44.2 | 6.99,25.27 v6.99,24.89 v8,24.89 10.67,24.89 11.56,24 L5.1 11.68,22.23 C46.1 | C64.2 14.99,33.66 13.84,33.66 C43.2 13.34,33.15 v12.19,33.15 v11.18,33.15 11.68,33.66 L4.1 v11.68,35.69 11.3,35.69 10.03,36.96 10.03,37.21
  Top 1.016: v8,37.21 v6.99,37.21 6.99,37.59 7.62,37.59 v8,37.21 | 10.03,37.21 C40.1 | v8,37.21 10.03,37.21 | v19.43,43.94 19.43,44.96 | v19.43,43.94 18.41,43.94 C47.1 18.41,44.96 19.43,44.96 | v19.43,43.94 20.83,43.94 | 19.43,44.96 20.32,44.96 C41.2 20.83,43.94 | R59.1 23.37,34.54 | 23.37,34.54 26.42,34.54 D2.3 26.42,34.04 v27.81,34.04 | 23.37,34.54 R60.1 | 20.83,43.94 v22.23,43.94 24,43.94 26.16,43.94 26.67,44.45 28.19,44.45 29.21,43.43 R58.1 C63.2 R56.1 | C65.2 R62.1 | D3.3 20.95,30.35 21.84,29.46 v24.26,29.46 | C22.1 v29.84,33.78 32.64,33.78 U2.3 | C24.2 20.7,23.75 v20.7,24.26 v20.7,25.27 | C213.2 v28.57,21.46 | 26.67,21.59 26.67,22.99 | C204.2 32.77,21.46 v31.11,21.46 | 32.77,23.62 31.11,23.62 | R86.2 31.11,19.94 v31.11,20.19 | 14.62,7.62 14.48,7.62 | 46.1,45.47 C20.2 44.96,45.72 C23.2 v43.81,46.99 43.81,49.15 | 46.1,45.47 46.61,45.47 C19.2 | R29.1 26.8,55.37 v26.16,54.74 | C37.1 24.13,52.58 23.62,53.09 v23.62,53.21 | C29.1 C28.1 v26.04,47.5 v24.77,47.5 | v47.24,44.09 47.24,44.07 46.13,44.07 v46.1,44.09 46.1,45.47 | R12.2 20.19,73.79 20.7,73.79 | v21.21,73.79 20.7,73.79 | 20.7,73.79 C25.2 | v17.14,74.04 17.14,77.34 17.14,78.49 SD/MMC.10 | SD/MMC.10 | SD/MMC.12 5.21,78.49 | 5.21,78.49 SD/MMC.10 | 5.21,78.49 4.45,78.49 2.79,76.83 | SD/MMC.13 4.45,62.99 4.45,64.52 | 43.81,51.31 C21.2 | 43.81,49.15 43.81,51.31 | 43.81,49.15 Q2.GND 41.27,51.05 | 3V_BAT.2 2.16,19.81 1.14,18.8 1.14,14.73 1.52,14.35 | U4.GND CON1.4 CON1.5 U4.GND@1 U4.GND
  Top 1.27: C204.2 32.77,23.62 C205.2 | C212.2 26.67,22.99 C213.2
  Top 1.524: PWR_JACK.- 5.62,8.36 7.32,6.65 PWR_JACK.-- 11.98,6.65 12.95,7.62 14.62,7.62 D4.A 14.88,7.87 18.54,7.87 21.21,10.54 21.65,10.54 C60.2 21.59,10.54 23.11,10.54 23.62,10.54 C61.2
  Bottom 0.254: 92.46,33.4 92.08,33.02 89.1,33.02 v88.62,32.54
  Bottom 0.406: 100.08,8.99 101.02,9.93 101.02,19.76 100.48,20.3 | v17.14,74.04 16.26,74.04 15.49,73.28 15.49,72.64 16.51,71.63 17.14,71.63
  Bottom 0.508: v69.7,27.64 69.42,27.64 68.71,26.92 68.71,26.54 68.33,26.16 63.6,26.16 | v49.28,35.43 46.61,35.43 v37.85,26.67 | v36.7,16.51 39.62,16.51 46.48,23.37 46.48,25.4
  Bottom 0.61: v56.39,27.74 56.39,28.02 57.23,28.85 v63.25,28.85 | v85.65,26.11 85.65,25.27 89.69,21.23 v92.56,21.23
  Bottom 0.762: v27.3,20.19 v27.3,18.92 v28.57,18.92 | v26.04,17.4 26.04,17.65 v27.3,17.65 v28.57,17.65 | v29.84,18.92 v29.84,17.65 | v52.32,46.61 52.32,47.24 50.42,49.15 v47.24,49.15
  Bottom 1.016: v64.72,55.07 v68.89,55.07 68.89,57.1 69.49,57.71 v77.52,57.71 | JTAG.4 JTAG.6 JTAG.8 JTAG.10 JTAG.12 JTAG.14 JTAG.16 JTAG.18 JTAG.20 | CON1.5 63.6,21.95 63.6,26.16 63.6,28.5 v63.25,28.85 | v85.45,41.66 81.99,41.66 | 81.99,41.66 81.99,41.55 | UEXT.2 92.46,33.4 | v80.77,37.16 81.99,38.38 81.99,41.66 | 40.13,61.21 38.91,62.43 38.91,69.29 37.97,70.23 31.62,70.23 | 40.13,61.21 40.64,60.71 42.29,60.71 43.05,59.94 v43.81,59.94 | v20.7,24.26 v20.7,25.27 24.26,28.83 v24.26,29.46 27.81,33.02 v27.81,34.04 29.59,34.04 v29.84,33.78 | U4.GND 59.44,17.78 v59.44,9.63 | 31.62,70.23 25.02,70.23 | 25.02,70.23 v25.02,68.33 | 24.13,64.14 U3.EP1 | 40.13,61.21 38.35,59.44 v38.35,58.42 v38.35,57.4 | v81.69,43.16 81.99,42.85 81.99,41.66 | 31.62,70.23 v31.62,71.88 | v22.99,9.02 v24,9.02 29.08,14.1 U14.EP1 | v36.7,16.51 v36.7,15.37 38.48,15.37 v42.04,11.81 | v27.3,20.19 v28.57,20.19 v29.84,20.19 | v8,24.89 11.05,24.89 v12.19,26.04 11.68,26.54 11.68,27.69 | 11.68,27.69 11.68,29.21 v12.19,29.72 v12.19,33.15 v11.18,33.15 8,36.32 v8,37.21 8,39.12 v8.89,40.01 9.14,40.26 9.14,42.04 | 11.68,27.69 v8.89,27.69 | 9.14,42.04 v9.14,42.93 | 9.14,42.04 13.84,42.04 14.73,42.93 18.41,42.93 v19.43,43.94 v22.23,43.94 v23.24,43.94 v24.26,43.94 24.77,44.45 28.19,44.45 30.35,42.29 44.32,42.29 46.1,44.07 v46.1,44.09 | 31.11,61.98 v31.11,54.23 v28.96,54.23 | v26.16,54.74 26.16,52.45 26.04,52.45 | v23.62,53.21 23.62,52.45 26.04,52.45 | 26.04,52.45 v26.04,47.5 | 25.02,70.23 22.99,70.23 21.84,69.09 21.84,67.56 v22.61,66.8 | v17.14,74.04 20.95,74.04 v21.21,73.79 | 5.71,7.75 6.81,6.65 PWR_JACK.-- 11.35,6.65 11.81,7.11 | 5.21,8.26 5.62,8.66 PWR_JACK.- 5.62,14.12 6.35,14.86
  Bottom 1.524: 3V_BAT.2 4.7,19.81 6.99,22.1 v6.99,24.89
  other vias: 45.97,49.15 10.16,83.31 79.35,70.21 73.76,51 80.57,9.75 89,7.32 54.76,7.11 72.95,10.36 89.1,20.52 79.55,60.86 71.93,57.61 71.83,61.87 69.09,61.67 83.92,9.75 93.88,1.32 87.47,57.8 77.72,51.69 31.11,17.65 31.11,18.92 29.84,21.46 24,7.87 22.99,7.87 36.83,26.67 59.44,10.64 56.52,10.77 56.52,9.63 54.76,5.97 13.72,83.31 19.3,83.31 19.3,82.17 8.38,75.31 9.4,75.31 8,70.23 9.4,70.23 65.89,71.98 64.74,71.98 42.8,49.15 11.56,23.62
  pour Bottom (isolate 0.406, rank 4): 106.68,88.9 -7.62,88.9 -7.62,-2.54 106.68,-2.54
  pour Top (isolate 0.406, rank 4): 109.22,91.44 -10.16,91.44 -10.16,-5.08 109.22,-5.08
  pour Bottom (no thermals): 27.3,66.67 27.3,61.59 31.75,61.59 31.75,66.67
LED  (via drill 0.4)
  Top 0.203: U1.7 53.94,47.79 51.94,49.78 51.94,50.55 50.55,51.94 v49.4,51.94
  Top 0.254: 9.65,80.77 10.29,81.41 v12.06,81.41
  Top 0.762: LED.C 9.65,80.77
  Bottom 0.203: v49.4,51.94 49.4,57.48 48.67,58.22 48.67,58.93 46.84,60.76 45.82,60.76 45.41,61.16 43.08,61.16 42.67,61.57 41.12,61.57 39.73,62.97 39.73,71.93 38.1,73.56 36.78,73.56 35.97,74.37 27.43,74.37 23.37,78.44 21.03,78.44 20.62,78.84 20.55,78.84
  Bottom 0.254: 20.55,78.84 15.9,78.84 13.34,81.41 v12.06,81.41
N$1
  Top 0.254: 47.24,37.72 48.01,37.72 49.15,38.86 51.82,38.86 52.74,39.79 U1.23
  Top 0.508: 48.39,41.27 46.35,39.24 46.35,38.23 R7.2 46.74,38.23 47.24,37.72 | C19.1 48.51,42.16 48.9,41.78
  Top 1.016: Q1.2 48.9,41.78 48.39,41.27
N$2
  Top 0.508: 45.34,41.27 45.34,38.23 R9.1 | Q1.1 43.43,42.04 C20.1
  Top 1.016: Q1.1 44.83,41.78 45.34,41.27
N$3
  Top 0.254: 47.37,36.96 47.62,37.21 48.26,37.21 49.4,38.35 52.07,38.35 53,39.29 U1.24
  Top 0.508: R9.2 R7.1 46.86,36.45 47.37,36.96
N$4
  Top 0.254: 90.02,46.2 88.39,44.58 88.32,44.5 RM5.2.1
  Top 1.016: 90.02,46.2 JTAG.17
N$5
  Top 0.508: LED.A R26.1
N$6
  Top 1.016: R36.1 PD.5
N$7
  Top 0.508: U10.3 22.35,40.33 22.35,38.73 R55.2
N$8
  Top 1.016: C47.2 14.86,44.96 14.73,45.09
  Top 1.27: LAN.GND2 13.77,46.05 14.73,45.09
  Top 1.524: LAN.GND1 12.57,51.69 LAN.GND2
  Bottom 1.524: LAN.GND2 LAN.GND1
N$9
  Top 0.254: R5.2 92.08,15.24 94.61,15.24 95,14.86
  Top 1.016: 95,14.86 B0_1/B0_0.2
N$11
  Top 0.254: USB_OTG1.VBUS 7.44,41.22 7.75,41.53
  Top 1.016: 7.75,41.53 7.87,41.66 10.03,41.66 C42.1 12.06,41.91 L8.2
N$12
  Top 0.406: 66.67,4.98 66.67,6.96
  Top 1.016: PG.14 66.67,4.7 66.67,4.98 | R44.2 66.67,9.93 66.67,6.96
N$13
  Bottom 0.508: PF10_E.2 32.38,7.21
  Bottom 0.762: 32.38,7.21 PF.13
N$14
  Top 0.406: 64.14,4.98 64.14,6.96
  Top 1.016: PG.16 64.14,4.7 64.14,4.98 | R45.2 64.14,9.93 64.14,6.96
N$15
  Bottom 0.508: PF6_E.2 37.47,7.21
  Bottom 0.762: 37.47,7.21 PF.9
N$16
  Bottom 0.508: PF8_E.2 34.92,7.21
  Bottom 0.762: 34.92,7.21 PF.11
N$17
  Bottom 0.254: 36.2,4.98 36.2,6.86
  Bottom 0.508: 36.2,7.21 PF7_E.1
  Bottom 0.762: 36.2,6.86 36.2,7.21
  Bottom 1.016: PF.10 36.2,4.7 36.2,4.98
N$18
  Top 1.016: PG.17 62.36,8 R46.1
N$19
  Bottom 0.254: 33.66,4.98 33.66,6.86
  Bottom 0.508: 33.66,7.21 PF9_E.1
  Bottom 0.762: 33.66,6.86 33.66,7.21
  Bottom 1.016: PF.12 33.66,4.7 33.66,4.98
N$21
  Top 0.406: USB_OTG2.VBUS 7.49,28.91 7.49,29.34
  Top 1.016: 7.49,29.34 7.87,29.72 C48.1 9.65,30.1 L9.2
N$22
  Top 0.508: U17.3 24.38,22.54 24.38,23.11
  Top 1.524: L16.1 24.38,24.71 24.38,23.11
N$23
  Top 0.508: U17.5 21.08,20.64 R92.1
  Top 0.762: R91.2 C211.2 R92.1
N$24
  Bottom 0.203: 69.62,4.29 69.22,4.7 PG7_E.1
  Bottom 1.016: PG.10 69.62,4.29
N$25  (via drill 0.4)
  Top 0.508: R30.1 v26.54,73.41 | 16.64,82.55 16.89,82.55 18.8,80.64 v18.8,77.85
  Top 0.762: R30.1 R32.2 C35.1
  Top 1.016: 16.64,82.55 WKUP.P$2
  Bottom 0.254: v26.54,73.41 26.54,74.42 23.11,77.85 v18.8,77.85
N$26
  Bottom 0.254: 30.73,81.28 31.11,80.9 31.11,78.74
  Bottom 0.508: PE5_E.1 31.11,78.36
  Bottom 0.762: 31.11,78.36 31.11,78.74
  Bottom 1.016: 30.73,81.28 PE.8
N$27
  Bottom 0.508: PE6_E.2 32.38,78.36
  Bottom 0.762: 32.38,78.36 PE.9
N$28
  Bottom 0.508: PE4_E.2 29.84,78.36
  Bottom 0.762: 29.84,78.36 PE.7
N$29
  Top 0.254: R3.2 94.61,12.7 95,12.32
  Top 1.016: 95,12.32 B1_1/B1_0.2
N$30
  Bottom 0.508: PE2_E.2 27.3,78.36
  Bottom 0.762: 27.3,78.36 PE.5
N$31
  Top 0.254: U3.19 30.47,67.96 29.84,68.58 | 29.84,72.14 30.48,72.77 33.02,72.77 R27.2
  Top 0.508: 29.84,68.58 R28.2
  Top 1.016: R28.2 C36.2 29.84,72.14
N$32
  Bottom 0.508: PG8_E.2 67.94,7.09
  Bottom 0.762: 67.94,7.09 PG.11
N$34
  Bottom 0.508: PG12_E.2 62.87,7.21
  Bottom 0.762: 62.87,7.21 PG.15
N$35
  Bottom 0.254: 61.59,4.98 61.59,6.86
  Bottom 0.508: 61.59,7.21 PG15_E.1
  Bottom 0.762: 61.59,6.86 61.59,7.21
  Bottom 1.016: PG.18 61.59,4.7 61.59,4.98
N$38
  Top 1.016: PG.13 R43.1
N$39
  Bottom 0.254: 31.11,5 31.11,6.86
  Bottom 0.508: 31.11,7.21 PF11_E.1
  Bottom 0.762: 31.11,6.86 31.11,7.21
  Bottom 1.016: PF.14 31.11,4.7 31.11,5
N$40  (via drill 0.4)
  Top 0.203: v22.73,20.19 22.99,19.94 23.5,19.94 C211.1
  Top 1.016: 3.3V_E.1 27.94,27.18 | 26.54,25.65 C212.1 | 26.54,26.04 28.57,26.04 | R91.1 C211.1
  Top 1.27: 3.3V_E.1 28.57,26.04 C213.1 | 26.54,25.65 25.78,26.42 v25.78,26.92
  Top 1.524: L16.2 23.57,27.18 27.94,27.18 | 26.54,25.65 26.54,26.04
  Bottom 0.406: v22.73,20.19 22.73,23.75 25.78,26.8 v25.78,26.92
N$41
  Top 0.203: 18.01,55.52 19.58,55.52
  Top 0.254: U3.29 26.29,63.88 25.53,63.12 25.53,60.07 24.26,58.8 R25.1 23.24,59.69 20.83,59.69 20.45,59.31 20.45,56.39 19.58,55.52 | 18.01,55.52 17.02,56.52 17.02,57.53 16.64,57.91
  Top 0.762: 16.25,58.3 16.64,57.91
  Top 1.016: LAN.1 16.25,58.3
N$42
  Top 0.254: U3.28 26.04,64.39 25.02,63.37 25.02,60.33 24.77,60.07 24.38,60.07 24.13,60.33 R24.1 24,61.09 23.11,60.2 20.57,60.2 19.94,59.56 19.94,56.54 19.38,55.98 18.21,55.98 17.53,56.67 17.53,57.4 17.65,57.53 18.29,57.53
  Top 0.762: LAN.2 18.77,57.05 18.29,57.53
N$43
  Top 0.254: U7.4 12.18,27.19 12.45,26.92 13.97,26.92 R41.2
N$44
  Top 0.254: U3.31 26.82,62.88 26.54,62.61 26.54,56.64 25.78,55.88 25.02,55.88 R23.1 23.24,55.88 21.72,55.88 21.08,55.24 21.08,48.13 20.45,47.5 17.65,47.5 16.76,48.39 16.76,50.16 16.56,50.37
  Top 1.016: LAN.7 16.25,50.68 16.56,50.37
N$47
  Top 0.254: U7.6 12.18,28.19 12.45,28.45 13.97,28.45 R42.2
N$48
  Top 0.508: U14.6 24.38,15.11 R108.1
N$49
  Top 0.254: U3.30 26.55,63.38 26.04,62.87 26.04,56.9 25.53,56.39 25.02,56.39 R22.1 23.24,56.39 21.46,56.39 20.57,55.5 20.57,48.39 20.19,48.01 17.91,48.01 17.27,48.64 17.27,49.78 17.53,50.04 18.14,50.04 18.39,49.78
  Top 1.016: 18.39,49.78 LAN.8
N$51
  Top 0.254: U5.6 12.06,40.51 12.32,40.77 13.84,40.77 R38.2
N$52
  Top 0.254: U5.4 12.06,39.51 12.32,39.24 13.84,39.24 R39.2
N$53  (via drill 0.4)
  Top 0.254: U3.2 28.47,60.98 28.07,60.58 28.07,59.94 28.83,59.18 v28.96,59.18
  Bottom 0.254: v28.96,59.18 28.96,58.17 27.05,56.26 27.05,47.24 26.16,46.35 22.48,46.35 21.08,44.96 15.49,44.96 13.72,43.18 10.29,43.18 8.89,44.58 7.11,44.58 5.21,46.48
  Bottom 1.016: LAN.KG 4.78,46.91 5.21,46.48
N$54  (via drill 0.4)
  Top 0.254: v28.96,60.33 v28.97,60.34 U3.3
  Bottom 0.254: v28.96,60.33 28.83,60.33 28.57,60.58 23.24,60.58 19.81,64.01 17.27,64.01 16.38,64.9 7.75,64.9 4.78,61.93
  Bottom 1.016: LAN.AY 4.78,61.93
N$55
  Top 0.254: R29.2 27.05,57.53 27.05,62.38 U3.32 27.3,62.38
N$56  (via drill 0.6)
  Top 1.016: R20.1 C37.2 v22.35,53.21
  Bottom 0.508: v22.35,53.21 20.32,53.21 19.06,51.95 LAN.6 17.78,52.94 17.78,53.59 16.23,55.15 LAN.3
N$57  (via drill 0.4)
  Top 0.508: v16.26,63.88 16.38,64.01 18.8,64.01 R31.1
  Bottom 0.254: 5.71,58.86 6.1,59.24 6.1,62.36 8.13,64.39 15.75,64.39 v16.26,63.88
  Bottom 1.016: LAN.KY 5.71,58.86
N$58
  Top 0.254: U3.6 30.47,57.8 C34.2
  Top 1.016: C34.2 C33.2
N$59  (via drill 0.6)
  Top 0.254: U3.27 26.29,64.9 C30.2 | U3.1 27.97,61.24 27.56,60.83 27.56,59.18 27.94,58.8 v27.94,58.55 | R23.2 23.24,54.1 24.13,54.1 24.51,53.72 v24.89,53.72
  Top 0.508: C32.2 28.7,57.4 28.7,57.78 v27.94,58.55 | R21.1 R20.2 24.38,50.93 24.77,50.93 25.78,51.94 L3.1
  Top 1.016: C30.2 C31.2 24.38,64.01 24.13,63.75 24.13,63.25 22.35,61.47 R24.2 v21.34,61.09 | v21.34,58.8 R25.2 R22.2 | L3.1 25.91,52.7 v24.89,53.72
  Bottom 0.762: v27.94,58.55 26.67,59.82 21.34,59.82
  Bottom 1.016: v21.34,61.09 21.34,59.82 v21.34,58.8 21.34,55.88 22.61,54.61 24,54.61 v24.89,53.72
N$63
  Top 0.254: U3.18 30.97,67.54 31.88,68.45 32.89,68.45 R14.2
N$65  (via drill 0.6)
  Top 0.762: v22.35,48.01 R21.2
  Bottom 0.254: 5.59,48.97 6.1,48.46 6.1,46.35 7.37,45.09 9.14,45.09 10.54,43.69 13.46,43.69 15.24,45.47 20.83,45.47 22.35,46.99 v22.35,48.01
  Bottom 1.016: 5.59,48.97 LAN.AG
N$66
  Top 0.508: U11.3 19.62,32.89 21.46,32.89 R59.2
N$67
  Top 0.762: U14.2 33.91,13.84 | 33.91,13.84 R79.2 | 33.91,13.84 R109.1
N$68
  Top 0.508: C200.1 28.19,11.05 26.67,12.57 U14.8
N$69
  Top 0.508: U14.1 31.78,12.29 32.51,11.56 33.02,11.56 33.02,10.79 C200.2
  Top 2.032: L19.1 41.4,15.37 38.99,12.95 38.99,11.84 D6.K
  Top 2.54: 33.02,11.56 D6.K
N$70
  Top 0.254: U14.3 32.38,15.11 33.02,15.75 33.02,16.13 33.53,16.64
  Top 0.762: 33.53,16.64 C201.1
N$71
  Top 0.762: C201.2 R85.1
N$72
  Top 0.254: R86.1 33.27,19.05 33.27,19.3 R80.1
  Top 0.508: U14.4 32.38,16.38 R86.1
N$75  (via drill 0.6)
  Top 1.016: 3V_BAT.1 4.32,17.27 7.62,13.97 v19.3,13.97 | D1.2 34.94,27.69 v36.07,27.69
  Bottom 1.016: v19.3,13.97 19.68,14.35 19.68,16.38 22.23,18.92 23.11,18.92 23.88,19.68 23.88,23.5 26.04,25.65 34.04,25.65 v36.07,27.69
N$78
  Top 0.762: SD/MMC.4 18.32,71.79 C25.1
  Top 1.27: C25.1 L2.2
N$85
  Top 0.254: 91.57,53.98 92.08,53.47 92.08,51.69 91.06,50.67 89.92,50.67 89.28,50.04 88.14,50.04 86.11,48.01 86.11,47.88 86.87,47.12 87.63,47.12 88.01,46.74 88.01,45.59 87.68,45.26 RM5.3.1
  Top 1.016: JTAG.11 90.93,54.61 91.57,53.98 | 86.11,47.88 R33.1
N$117
  Top 0.254: C1.2 74.29,29.95 U1.71
N$119
  Top 0.508: CD1.1 32.51,49.02 R35.2
N$128
  Top 0.203: 76.33,51.33 76.1,51.1 76.1,49.99 76.3,49.79 U1.106
  Top 0.254: C15.2 76.2,54.74 76.2,54.36 76.33,54.23 76.33,51.33
N$129
  Top 0.508: R50.2 17.78,5.08 17.78,3.94 PWR_LED.A
N$163  (via drill 0.4)
  Top 0.254: 9.63,2.29 10.9,1.02 19.56,1.02 21.84,3.3 v21.84,7.49
  Top 0.762: C22.2 R8.2 v30.86,29.46 31.11,29.46 R6.1 31.75,31.92 U2.1
  Top 0.813: RESET.P$1 9.63,2.29
  Bottom 0.203: 18.41,12.7 18.41,14.38 18.8,14.76 18.8,16.69 20.19,18.09 20.19,18.11
  Bottom 0.254: v21.84,7.49 21.46,7.87 21.46,9.65 18.41,12.7 | 20.19,18.11 21.97,19.89 21.97,24.26 25.53,27.81 26.8,27.81 28.45,29.46 v30.86,29.46
N$470
  Top 0.203: U1.143 57.79,56.11
  Top 1.016: C4.2 57.79,56.11 R2.1 R1.1
PA0/WKUP
  Top 0.203: U1.34 54.17,34.29 53.72,33.83 53.72,30 53.09,29.36 43.16,29.36 39.88,32.64 39.88,36.45 36.96,39.37 36.96,46.35 37.47,46.86 37.47,47.88
  Top 0.254: 27.05,69.98 27.43,70.36 27.43,73.28 28.96,74.8 37.97,74.8 41.27,71.5 41.27,63.25 42.93,61.59 42.93,55.75 42.42,55.24 40.51,55.24 37.08,51.82 37.08,48.26 37.47,47.88
  Top 0.508: 27.05,69.98 R30.2
PA1/D8/ETH_RMII_REF_CLK  (via drill 0.4)
  Top 0.203: U1.35 54.39,33.79 54.13,33.53 54.13,29.84 53.24,28.96 42.93,28.96 39.37,32.51 39.37,36.2 36.45,39.12 36.45,46.86 36.7,47.12 v36.7,47.37
  Top 0.254: U3.5 29.97,53.59 30.23,53.34 v30.23,53.09
  Top 0.762: CD1.3 30.23,51.94 v30.23,53.09
  Bottom 0.254: v36.7,47.37 35.94,47.37 v30.23,53.09
PA2/ETH_RMII_MDIO  (via drill 0.4)
  Top 0.203: U1.36 54.6,33.29 54.53,33.22 54.53,29.69 53.39,28.55 42.7,28.55 38.86,32.38 38.86,36.07 35.94,38.99 35.94,48.51 v36.32,48.9
  Top 0.254: U3.16 32.23,65.89 33.02,66.67 33.78,66.67 v34.04,66.93 34.54,67.44 RM2.4.2
  Bottom 0.254: v34.04,66.93 36.2,64.77 36.2,61.09 35.69,60.58 35.69,53.34 36.32,52.7 v36.32,48.9
PA3/ETH_RMII_MDINT
  Top 0.203: U1.37 57.29,30.67 57.15,30.53 55.93,30.53 53.54,28.14 42.47,28.14 38.35,32.26 38.35,35.94 35.43,38.86 35.43,49.15
  Top 0.254: 35.43,49.15 36.45,50.16 36.45,52.07 39.24,54.86 39.24,61.47 38.73,61.98 38.73,69.85 37.85,70.74 36.32,70.74
  Top 1.016: R14.1 R13.1 36.32,70.74
PA4/D10/SPI1_NSS  (via drill 0.4)
  Top 0.203: U1.40 58.79,31.97 59.59,32.77 62.18,32.77 62.99,33.58 62.99,34.82 62.48,35.33 62.48,36.6 61.06,38.02 61.06,41.83 56.29,46.61 v56.29,46.94 | v49.38,58.52 50.37,58.52 51.31,59.46 51.31,59.94 55.17,63.8 55.24,63.8
  Top 1.016: U4.D10 55.24,65.91 CON4.3 55.24,63.8
  Bottom 0.203: v56.29,46.94 56.19,46.94 55.68,47.45 54.08,47.45 50.19,51.33 50.19,57.71 v49.38,58.52
PA5/D13/SPI1_SCK  (via drill 0.4)
  Top 0.203: U1.41 59.29,31.86 59.79,32.36 62.33,32.36 63.4,33.43 63.4,34.98 62.89,35.48 62.89,36.75 61.47,38.18 61.47,41.99 57.3,46.15 v57.3,46.94
  Top 0.508: v48.56,60.05 47.62,60.98 47.62,63.4
  Top 1.016: U4.D13 47.62,65.91 CON4.6 47.62,63.4
  Bottom 0.203: v57.3,46.94 56.39,47.85 54.23,47.85 50.6,51.49 50.6,58.29 49.66,59.23 49.38,59.23 v48.56,60.05
PA6/D12/SPI1_MISO  (via drill 0.4)
  Top 0.203: U1.42 59.79,31.75 59.99,31.95 62.48,31.95 63.8,33.27 63.8,35.13 63.3,35.64 63.3,36.91 61.87,38.33 61.87,42.14 58.32,45.7 v58.32,46.94
  Top 0.508: v49.58,60.05 50.16,60.63 50.16,63.4
  Top 1.016: U4.D12 50.16,65.91 CON4.5 50.16,63.4
  Bottom 0.203: v58.32,46.94 57.61,47.65 57.2,47.65 56.59,48.26 54.38,48.26 51,51.64 51,58.45 49.58,59.87 v49.58,60.05
PA7/D11/ETH_RMII_CRS_DV  (via drill 0.4)
  Top 0.203: U1.43 60.29,30.39 59.13,29.23 59.13,28.12 57.94,26.92 56.06,26.92 55.24,27.74 42.24,27.74 37.85,32.13 37.85,35.81 34.92,38.73 34.92,49.66 35.18,49.91 v35.18,50.04
  Top 0.254: U3.15 33,65.39 v33.4,65.79 33.78,66.17 34.54,66.17 34.92,66.55 RM2.3.2
  Bottom 0.254: v33.4,65.79 32.64,65.02 32.64,62.1 32,61.47 32,60.45 32.89,59.56 32.89,57.15 34.16,55.88 34.16,51.05 v35.18,50.04
PA8/USB_HS_VBUSON  (via drill 0.4)
  Top 0.203: U1.100 75.89,46.79 75.74,46.94 71.32,46.94 70.99,46.61 70.18,46.61
  Top 0.254: v69.7,47.09 70.18,46.61
  Top 0.508: U11.4 19.62,36.2 v20.45,36.2 21.59,36.2 R60.2
  Bottom 0.203: 52.07,42.8 52.63,43.36 65.84,43.36 65.91,43.43
  Bottom 0.254: v20.45,36.2 25.02,36.2 25.91,37.08 28.96,37.08 31.5,39.62 48.9,39.62 52.07,42.8 | v69.7,47.09 69.57,47.09 65.91,43.43
PA9/OTG_FS_VBUS  (via drill 0.4)
  Top 0.203: U1.101 75.95,47.29 75.82,47.42 70.79,47.42 v70.74,47.37
  Top 0.762: R37.1 v30.99,37.59
  Bottom 0.203: 52.58,42.55 52.98,42.95 66.19,42.95 66.29,43.05
  Bottom 0.254: v30.99,37.59 32.51,39.12 49.15,39.12 52.58,42.55 | v70.74,47.37 70.74,46.99 69.98,46.23 69.47,46.23 66.29,43.05
PA10/OTG1_FS_ID  (via drill 0.4)
  Top 0.203: U1.102 76.01,47.79 75.89,47.9 71.35,47.9 71.09,48.16 69.29,48.16 v68.89,47.75
  Top 0.254: v24.51,36.96 24.26,37.21 15.88,37.21 15.49,36.83 14.86,36.83 13.84,37.85 13.34,37.85 12.95,38.23 8.89,38.23 8.38,38.73 6.99,38.73 USB_OTG1.ID
  Top 0.762: D2.2 25.47,36.96 v24.51,36.96
  Bottom 0.203: 51.82,43.31 52.27,43.76 65.48,43.76 65.53,43.81
  Bottom 0.254: v24.51,36.96 25.15,37.59 28.7,37.59 31.24,40.13 48.64,40.13 51.82,43.31 | v68.89,47.75 68.89,47.17 65.53,43.81
PA11/OTG_FS_DM  (via drill 0.4)
  Top 0.254: R38.1 16.38,40.01 v18.03,40.01 | U1.103 76.17,48.29 75.82,48.64 68.96,48.64 68.45,49.15 v68.45,49.4
  Top 0.508: C38.1 18.67,40.01 v18.03,40.01